# EAGLE design MJ818 clone - rev.5 - TCAN334 - poc (EAGLE 9.6.2)
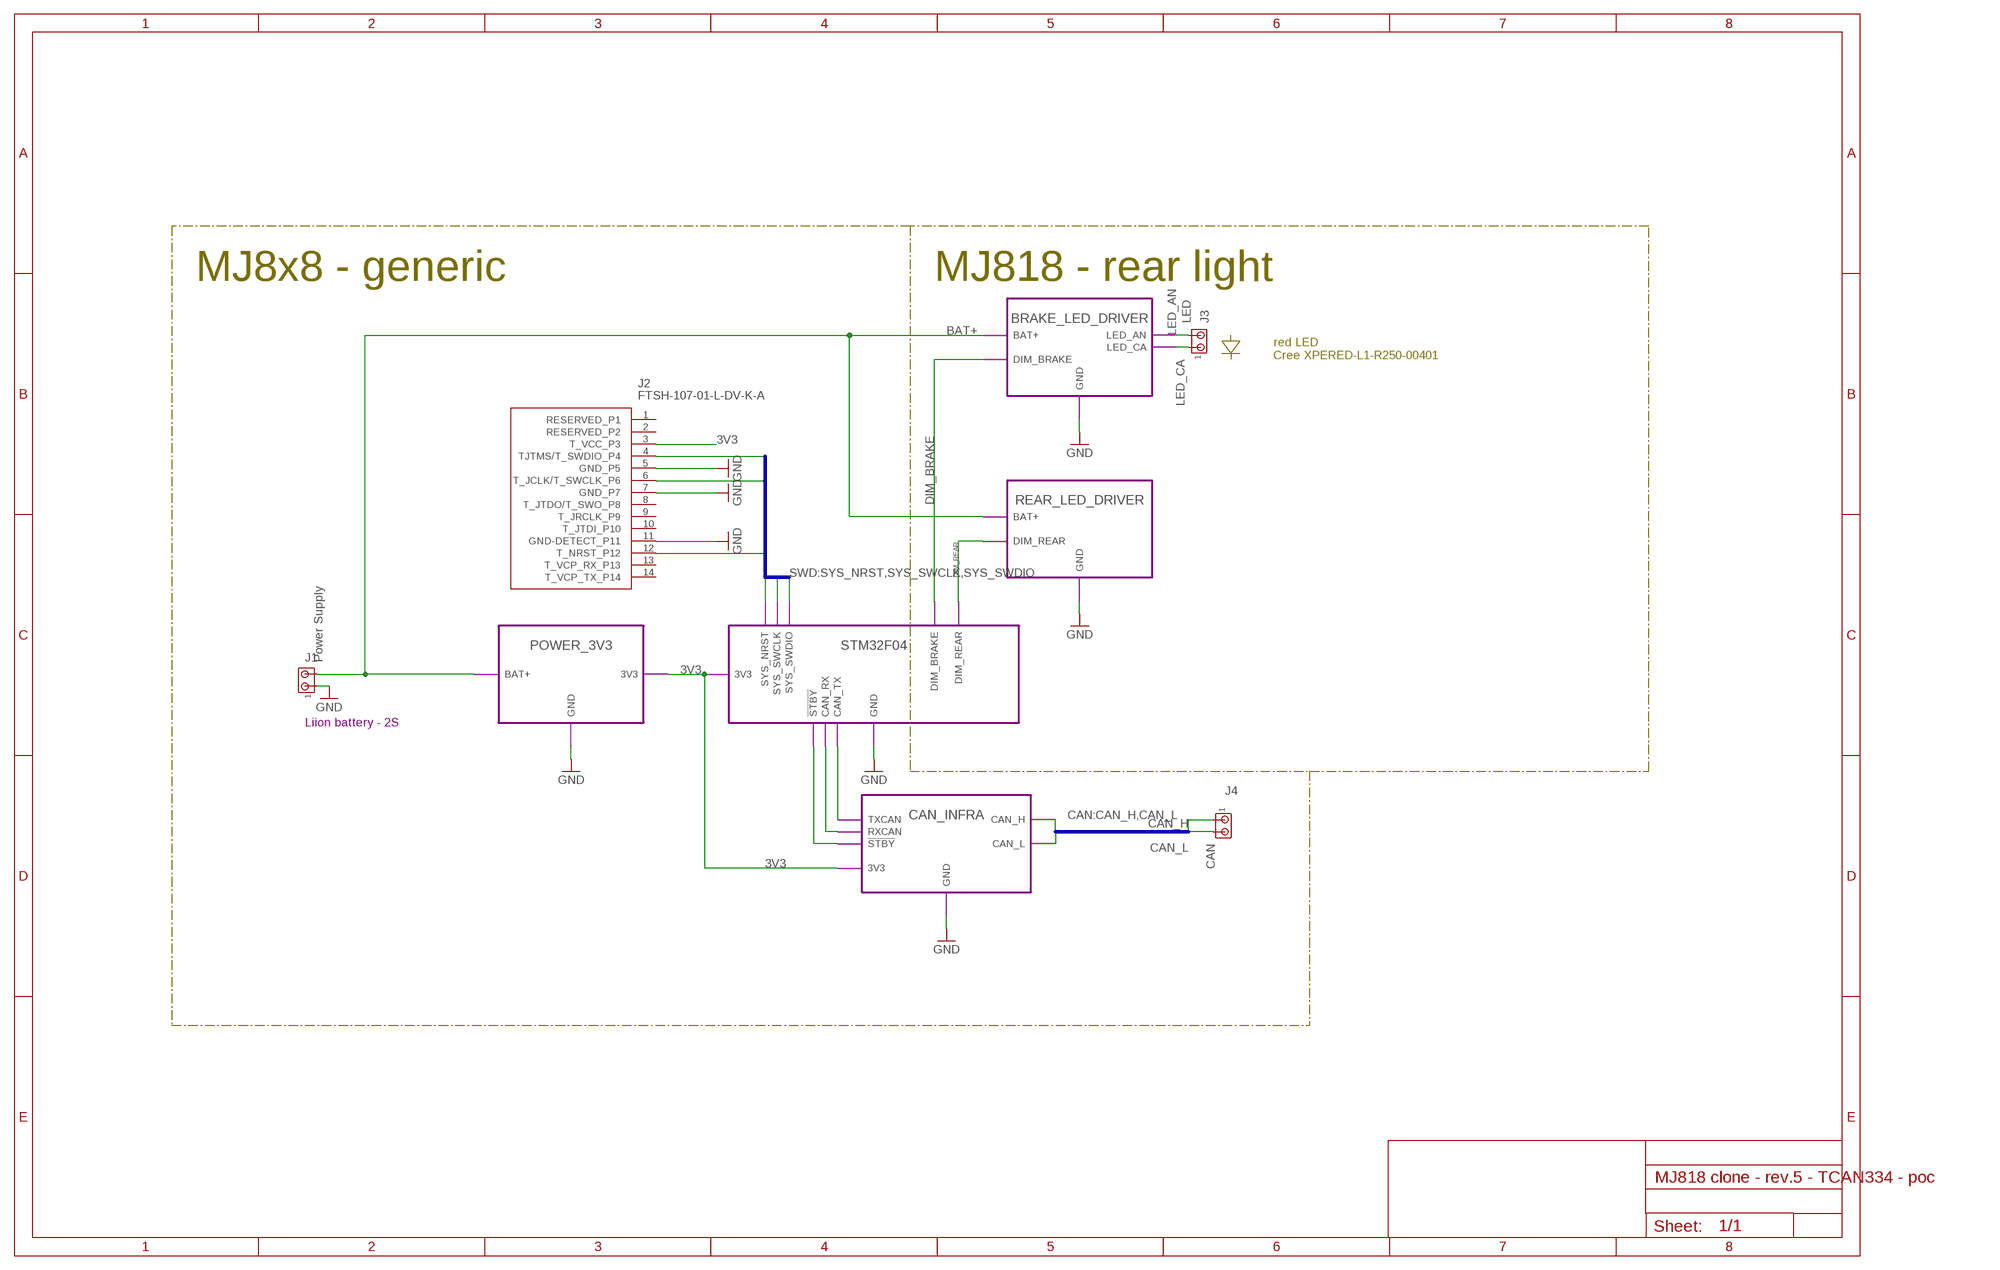
[diagram p0: schematic, sheet 1]

## Parts
J1  Power Supply  MTA02-100  [10X02MTA]
J2  FTSH-107-01-L-DV-K-A  [FTSH10701LDVKA]
J3  LED  MTA02-100  [10X02MTA]
J4  CAN  MTA02-100  [10X02MTA]

## Module instances
POWER_3V3 = POWER_3V3 (part numbers offset by 200)
STM32F04 = STM32 (part numbers offset by 300)
CAN_INFRA = CAN_INFRA (part numbers offset by 400)
BRAKE_LED_DRIVER = LED_DRIVER_BRAKE-LIGHT (part numbers offset by 500)
REAR_LED_DRIVER = LED_DRIVER_REAR-LIGHT (part numbers offset by 600)

## Nets
3V3 [3V3]: J2.3(T_VCC_P3) ; port POWER_3V3.3V3 STM32F04.3V3 CAN_INFRA.3V3
!STBY! [signal]: port CAN_INFRA.!STBY! STM32F04.!STBY!
BAT+ [BAT+]: J1.2 ; port POWER_3V3.BAT+ BRAKE_LED_DRIVER.BAT+ REAR_LED_DRIVER.BAT+
CAN_H [signal]: J4.1 ; port CAN_INFRA.CAN_H
CAN_L [signal]: J4.2 ; port CAN_INFRA.CAN_L
CAN_RX [signal]: port CAN_INFRA.RXCAN STM32F04.CAN_RX
CAN_TX [signal]: port CAN_INFRA.TXCAN STM32F04.CAN_TX
DIM_BRAKE [signal]: port STM32F04.DIM_BRAKE BRAKE_LED_DRIVER.DIM_BRAKE
DIM_REAR [signal]: port STM32F04.DIM_REAR REAR_LED_DRIVER.DIM_REAR
GND: J1.1 J2.5(GND_P5) J2.7(GND_P7) J2.11(GND-DETECT_P11) ; port STM32F04.GND POWER_3V3.GND CAN_INFRA.GND BRAKE_LED_DRIVER.GND REAR_LED_DRIVER.GND
LED_AN [BAT+]: J3.2 ; port BRAKE_LED_DRIVER.LED_AN
LED_CA [BAT+]: J3.1 ; port BRAKE_LED_DRIVER.LED_CA
SYS_NRST [signal]: J2.12(T_NRST_P12) ; port STM32F04.SYS_NRST
SYS_SWCLK [signal]: J2.6(T_JCLK/T_SWCLK_P6) ; port STM32F04.SYS_SWCLK
SYS_SWDIO [signal]: J2.4(TJTMS/T_SWDIO_P4) ; port STM32F04.SYS_SWDIO
Unconnected: J2.1(RESERVED_P1) J2.2(RESERVED_P2) J2.8(T_JTDO/T_SWO_P8) J2.9(T_JRCLK_P9) J2.10(T_JTDI_P10) J2.13(T_VCP_RX_P13) J2.14(T_VCP_TX_P14)

## Buses
CAN:CAN_H,CAN_L
SWD:SYS_NRST,SYS_SWCLK,SYS_SWDIO

## Notes on the sheet
- MJ8x8 - generic | MJ818 - rear light
- red LED
  Cree XPERED-L1-R250-00401
- Liion battery - 2S

## Library data of the parts
J1 J3 J4 = con-amp:MTA02-100: AMP connector
J2 = STM32 JTAG 1.27mm 14pin header:FTSH-107-01-L-DV-K-A: Headers & Wire Housings .050" Micro Terminal Strip Source: Datasheet <https://componentsearchengine.com/Datasheets/1/FTSH-107-01-L-DV-K-A.pdf>; DESCRIPTION: Headers & Wire Housings .050" Micro Terminal Strip; HEIGHT: 5.97mm; MANUFACTURER_NAME: SAMTEC; MANUFACTURER_PART_NUMBER: FTSH-107-01-L-DV-K-A; MOUSER_PART_NUMBER: 200-FTSH10701LDVKA; MOUSER_PRICE-STOCK: https://www.mouser.com/Search/Refine.aspx?Keyword=200-FTSH10701LDVKA

## Module POWER_3V3
Ports: GND(pwr) BAT+(pwr) 3V3(pwr)
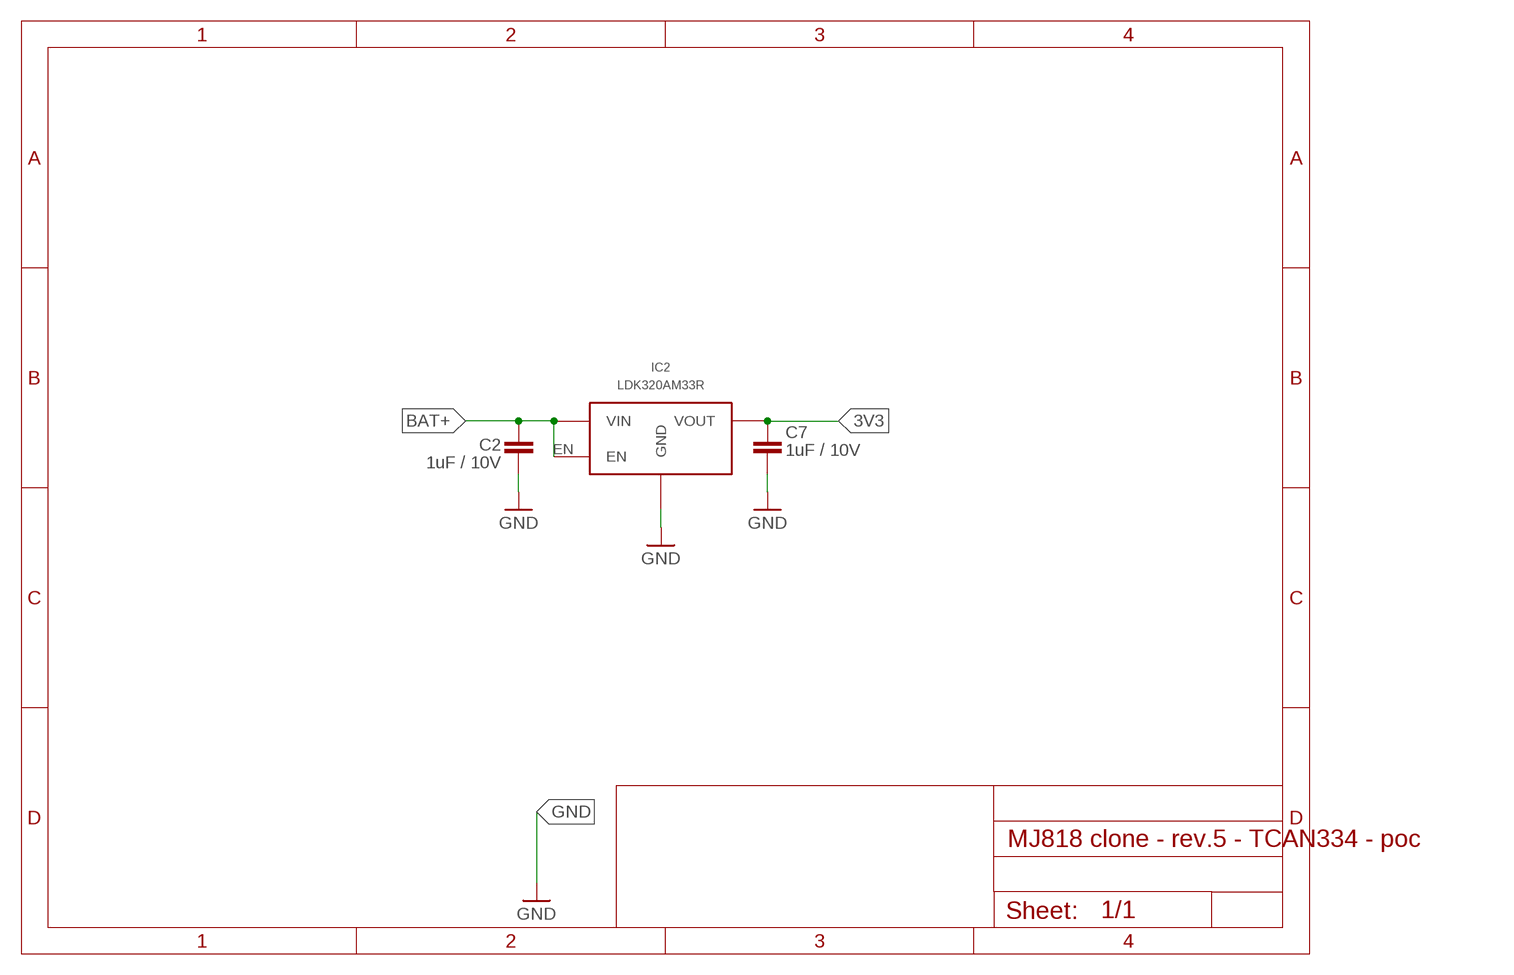
[diagram p1: schematic, module POWER_3V3, sheet 1]

### Parts
C2  1uF / 10V  C-EUC0402  [C0402]
C7  1uF / 10V  C-EUC0402  [C0402]
IC2  LDK320AM33R  LDK320SOT-23-5L  [SOT-23-5L]

### Nets
3V3: C7.2 IC2.OUT(VOUT)
BAT+ [BAT+]: C2.1 IC2.EN IC2.IN(VIN)
GND: C2.2 C7.1 IC2.GND

### Library data of the parts
C2 C7 = rcl:C-EU: CAPACITOR, European symbol; SPICEPREFIX: C
IC2 = LDK320 5V LDO:LDK320

## Module STM32
Ports: GND(pwr) 3V3(pwr) SYS_NRST(in) SYS_SWCLK(io) SYS_SWDIO(io) CAN_RX(in) CAN_TX(out) !STBY!(out) DIM_REAR(out) DIM_BRAKE(out)
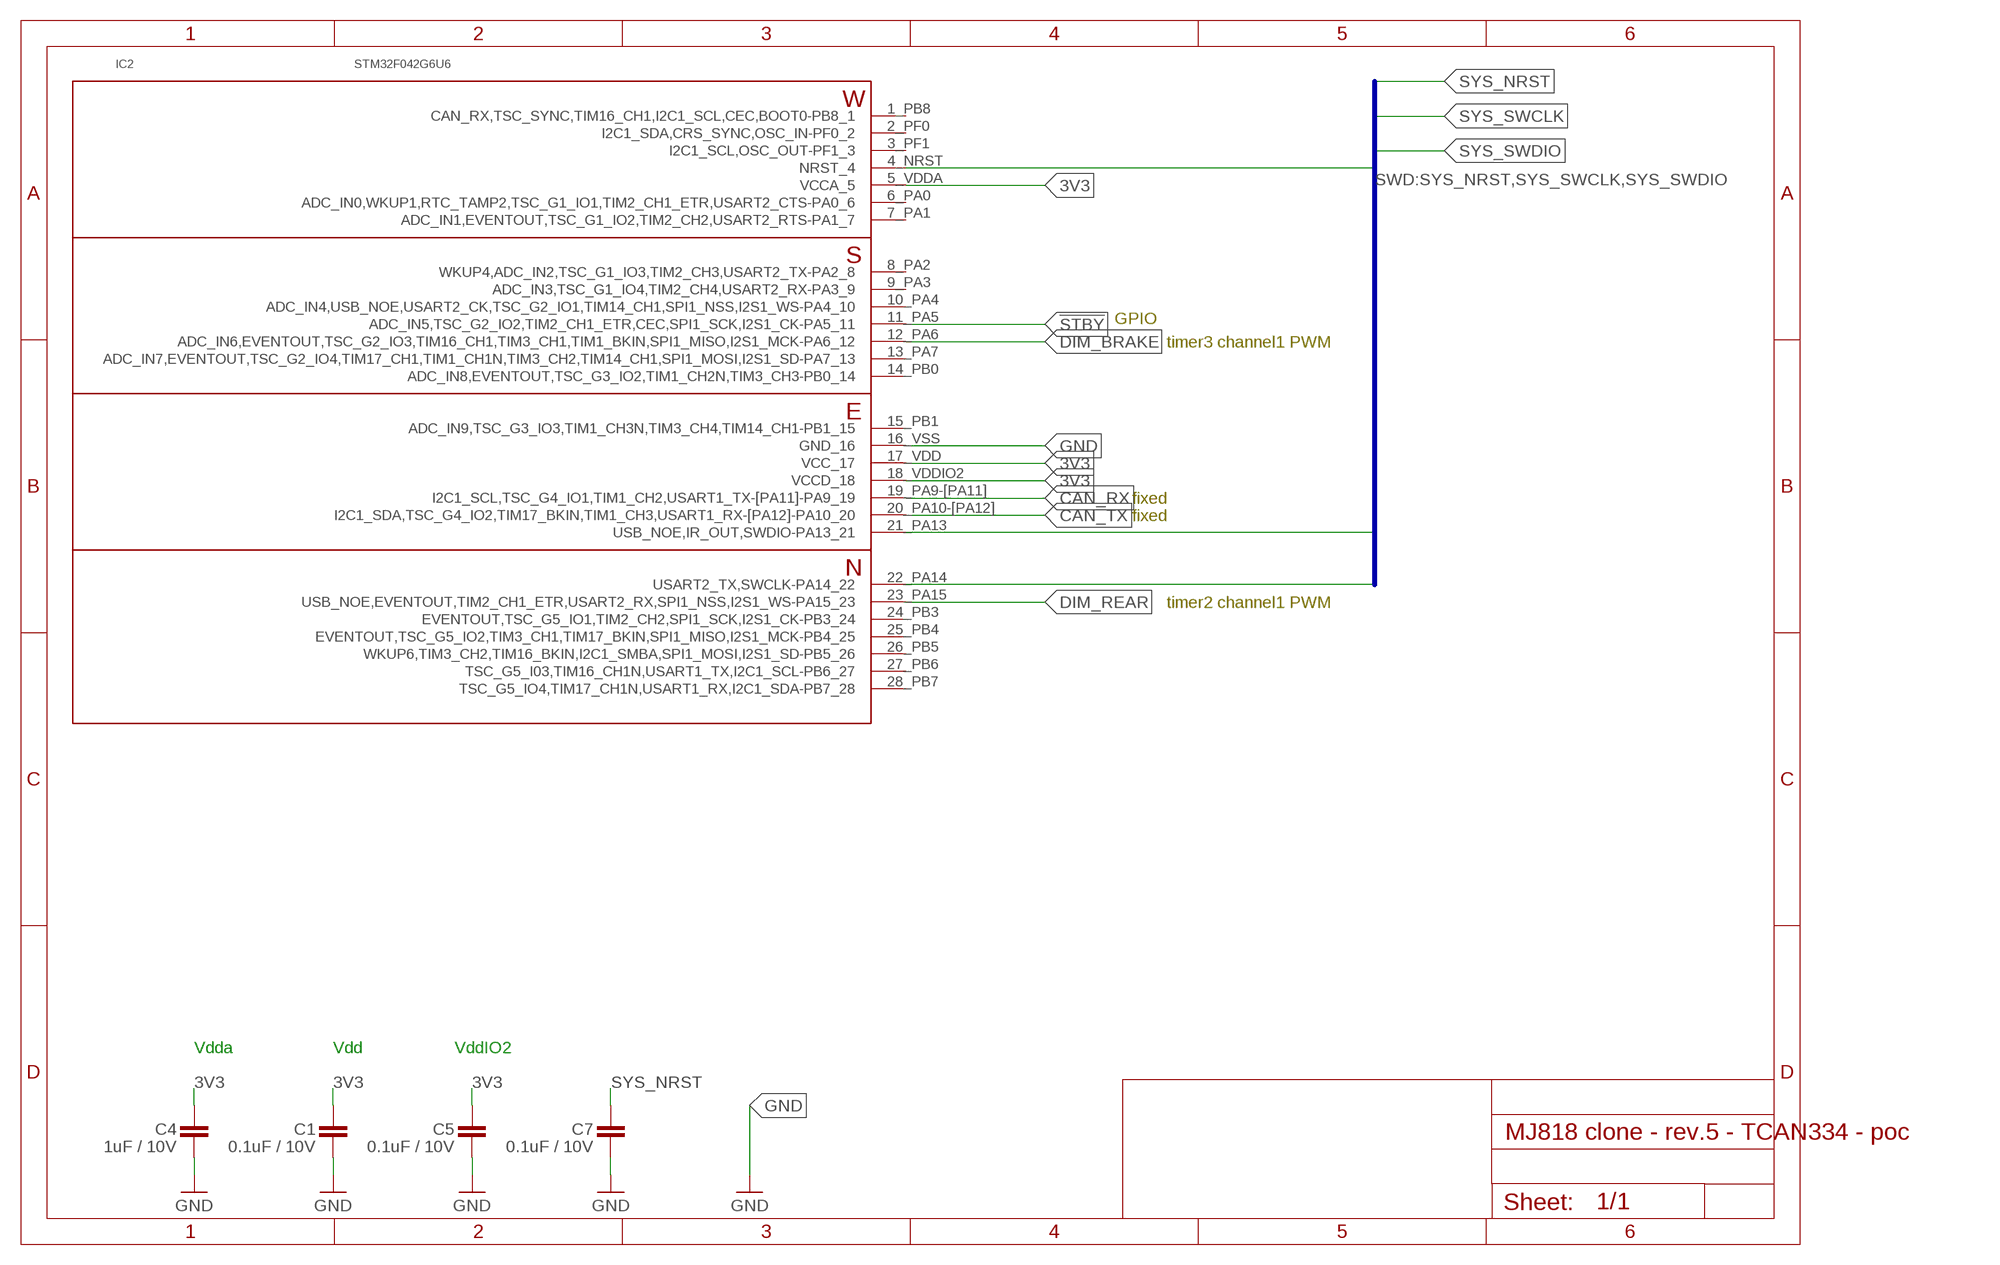
[diagram p2: schematic, module STM32, sheet 1]

### Parts
C1  0.1uF / 10V  C-EUC0402  [C0402]
C4  1uF / 10V  C-EUC0402  [C0402]
C5  0.1uF / 10V  C-EUC0402  [C0402]
C7  0.1uF / 10V  C-EUC0402  [C0402]
IC2  STM32F042G6U6  STM32F042G6  [UFQFPN-28]

### Nets
3V3 [3V3]: C1.2 C4.2 C5.2 IC2.5_VDDA(VCCA_5) IC2.17_VDD(VCC_17) IC2.18_VDDIO2(VCCD_18)
!STBY!: IC2.11_PA5(ADC_IN5,TSC_G2_IO2,TIM2_CH1_ETR,CEC,SPI1_SCK,I2S1_CK-PA5_11)
CAN_RX: IC2.19_PA9-[PA11](I2C1_SCL,TSC_G4_IO1,TIM1_CH2,USART1_TX-[PA11]-PA9_19)
CAN_TX: IC2.20_PA10-[PA12](I2C1_SDA,TSC_G4_IO2,TIM17_BKIN,TIM1_CH3,USART1_RX-[PA12]-PA10_20)
DIM_BRAKE: IC2.12_PA6(ADC_IN6,EVENTOUT,TSC_G2_IO3,TIM16_CH1,TIM3_CH1,TIM1_BKIN,SPI1_MISO,I2S1_MCK-PA6_12)
DIM_REAR: IC2.23_PA15(USB_NOE,EVENTOUT,TIM2_CH1_ETR,USART2_RX,SPI1_NSS,I2S1_WS-PA15_23)
GND: C1.1 C4.1 C5.1 C7.1 IC2.16_VSS(GND_16)
SYS_NRST: C7.2 IC2.4_NRST(NRST_4)
SYS_SWCLK: IC2.22_PA14(USART2_TX,SWCLK-PA14_22)
SYS_SWDIO: IC2.21_PA13(USB_NOE,IR_OUT,SWDIO-PA13_21)
Unconnected: IC2.1_PB8(CAN_RX,TSC_SYNC,TIM16_CH1,I2C1_SCL,CEC,BOOT0-PB8_1) IC2.2_PF0(I2C1_SDA,CRS_SYNC,OSC_IN-PF0_2) IC2.3_PF1(I2C1_SCL,OSC_OUT-PF1_3) IC2.6_PA0(ADC_IN0,WKUP1,RTC_TAMP2,TSC_G1_IO1,TIM2_CH1_ETR,USART2_CTS-PA0_6) IC2.7_PA1(ADC_IN1,EVENTOUT,TSC_G1_IO2,TIM2_CH2,USART2_RTS-PA1_7) IC2.8_PA2(WKUP4,ADC_IN2,TSC_G1_IO3,TIM2_CH3,USART2_TX-PA2_8) IC2.9_PA3(ADC_IN3,TSC_G1_IO4,TIM2_CH4,USART2_RX-PA3_9) IC2.10_PA4(ADC_IN4,USB_NOE,USART2_CK,TSC_G2_IO1,TIM14_CH1,SPI1_NSS,I2S1_WS-PA4_10) IC2.13_PA7(ADC_IN7,EVENTOUT,TSC_G2_IO4,TIM17_CH1,TIM1_CH1N,TIM3_CH2,TIM14_CH1,SPI1_MOSI,I2S1_SD-PA7_13) IC2.14_PB0(ADC_IN8,EVENTOUT,TSC_G3_IO2,TIM1_CH2N,TIM3_CH3-PB0_14) IC2.15_PB1(ADC_IN9,TSC_G3_IO3,TIM1_CH3N,TIM3_CH4,TIM14_CH1-PB1_15) IC2.24_PB3(EVENTOUT,TSC_G5_IO1,TIM2_CH2,SPI1_SCK,I2S1_CK-PB3_24) IC2.25_PB4(EVENTOUT,TSC_G5_IO2,TIM3_CH1,TIM17_BKIN,SPI1_MISO,I2S1_MCK-PB4_25) IC2.26_PB5(WKUP6,TIM3_CH2,TIM16_BKIN,I2C1_SMBA,SPI1_MOSI,I2S1_SD-PB5_26) IC2.27_PB6(TSC_G5_I03,TIM16_CH1N,USART1_TX,I2C1_SCL-PB6_27) IC2.28_PB7(TSC_G5_IO4,TIM17_CH1N,USART1_RX,I2C1_SDA-PB7_28)

### Buses
SWD:SYS_NRST,SYS_SWCLK,SYS_SWDIO

### Notes on the sheet
- GPIO
- timer3 channel1 PWM
- fixed
- fixed
- timer2 channel1 PWM
- Vdda | Vdd | VddIO2

### Library data of the parts
C1 C4 C5 C7 = rcl:C-EU: CAPACITOR, European symbol; SPICEPREFIX: C
IC2 = STM32F042G6:STM32F042G6

## Module CAN_INFRA
Ports: GND(pwr) 3V3(pwr) CAN_H(io) CAN_L(io) TXCAN(in) RXCAN(out) !STBY!(in)
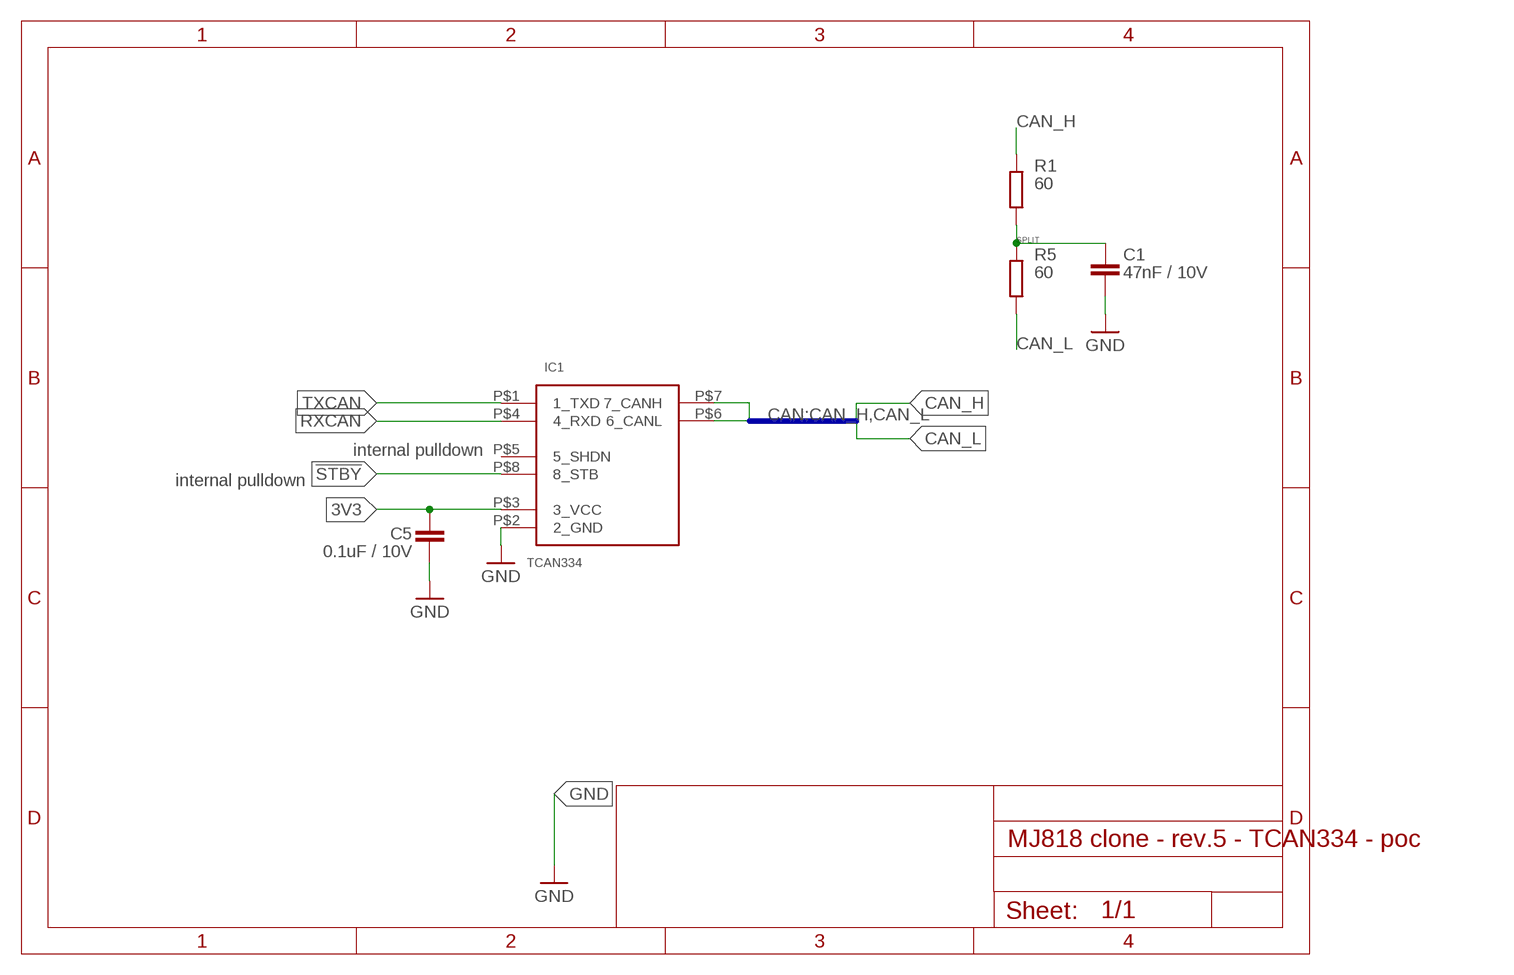
[diagram p3: schematic, module CAN_INFRA, sheet 1]

### Parts
C1  47nF / 10V  C-EUC0402  [C0402]
C5  0.1uF / 10V  C-EUC0402  [C0402]
IC1  TCAN334  CAN33X  [SOT23-8]
R1  60  R-EU_R0805  [R0805]
R5  60  R-EU_R0805  [R0805]

### Nets
3V3 [3V3]: C5.1 IC1.P$3(3_VCC)
!STBY! [signal]: IC1.P$8(8_STB)
CAN_H: IC1.P$7(7_CANH) R1.2
CAN_L: IC1.P$6(6_CANL) R5.1
GND: C1.2 C5.2 IC1.P$2(2_GND)
RXCAN [signal]: IC1.P$4(4_RXD)
SPLIT [signal]: C1.1 R1.1 R5.2
TXCAN [signal]: IC1.P$1(1_TXD)
Unconnected: IC1.P$5(5_SHDN)

### Buses
CAN:CAN_H,CAN_L

### Notes on the sheet
- internal pulldown
- internal pulldown

### Library data of the parts
C1 C5 = rcl:C-EU: CAPACITOR, European symbol; SPICEPREFIX: C
IC1 = TCAN33x - 3.3V CAN Transciever:CAN33X
R1 R5 = rcl:R-EU_: RESISTOR, European symbol; SPICEPREFIX: R

## Module LED_DRIVER_BRAKE-LIGHT
Ports: GND(pwr) LED_AN(pwr) LED_CA(pwr) DIM_BRAKE(in) BAT+(pwr)
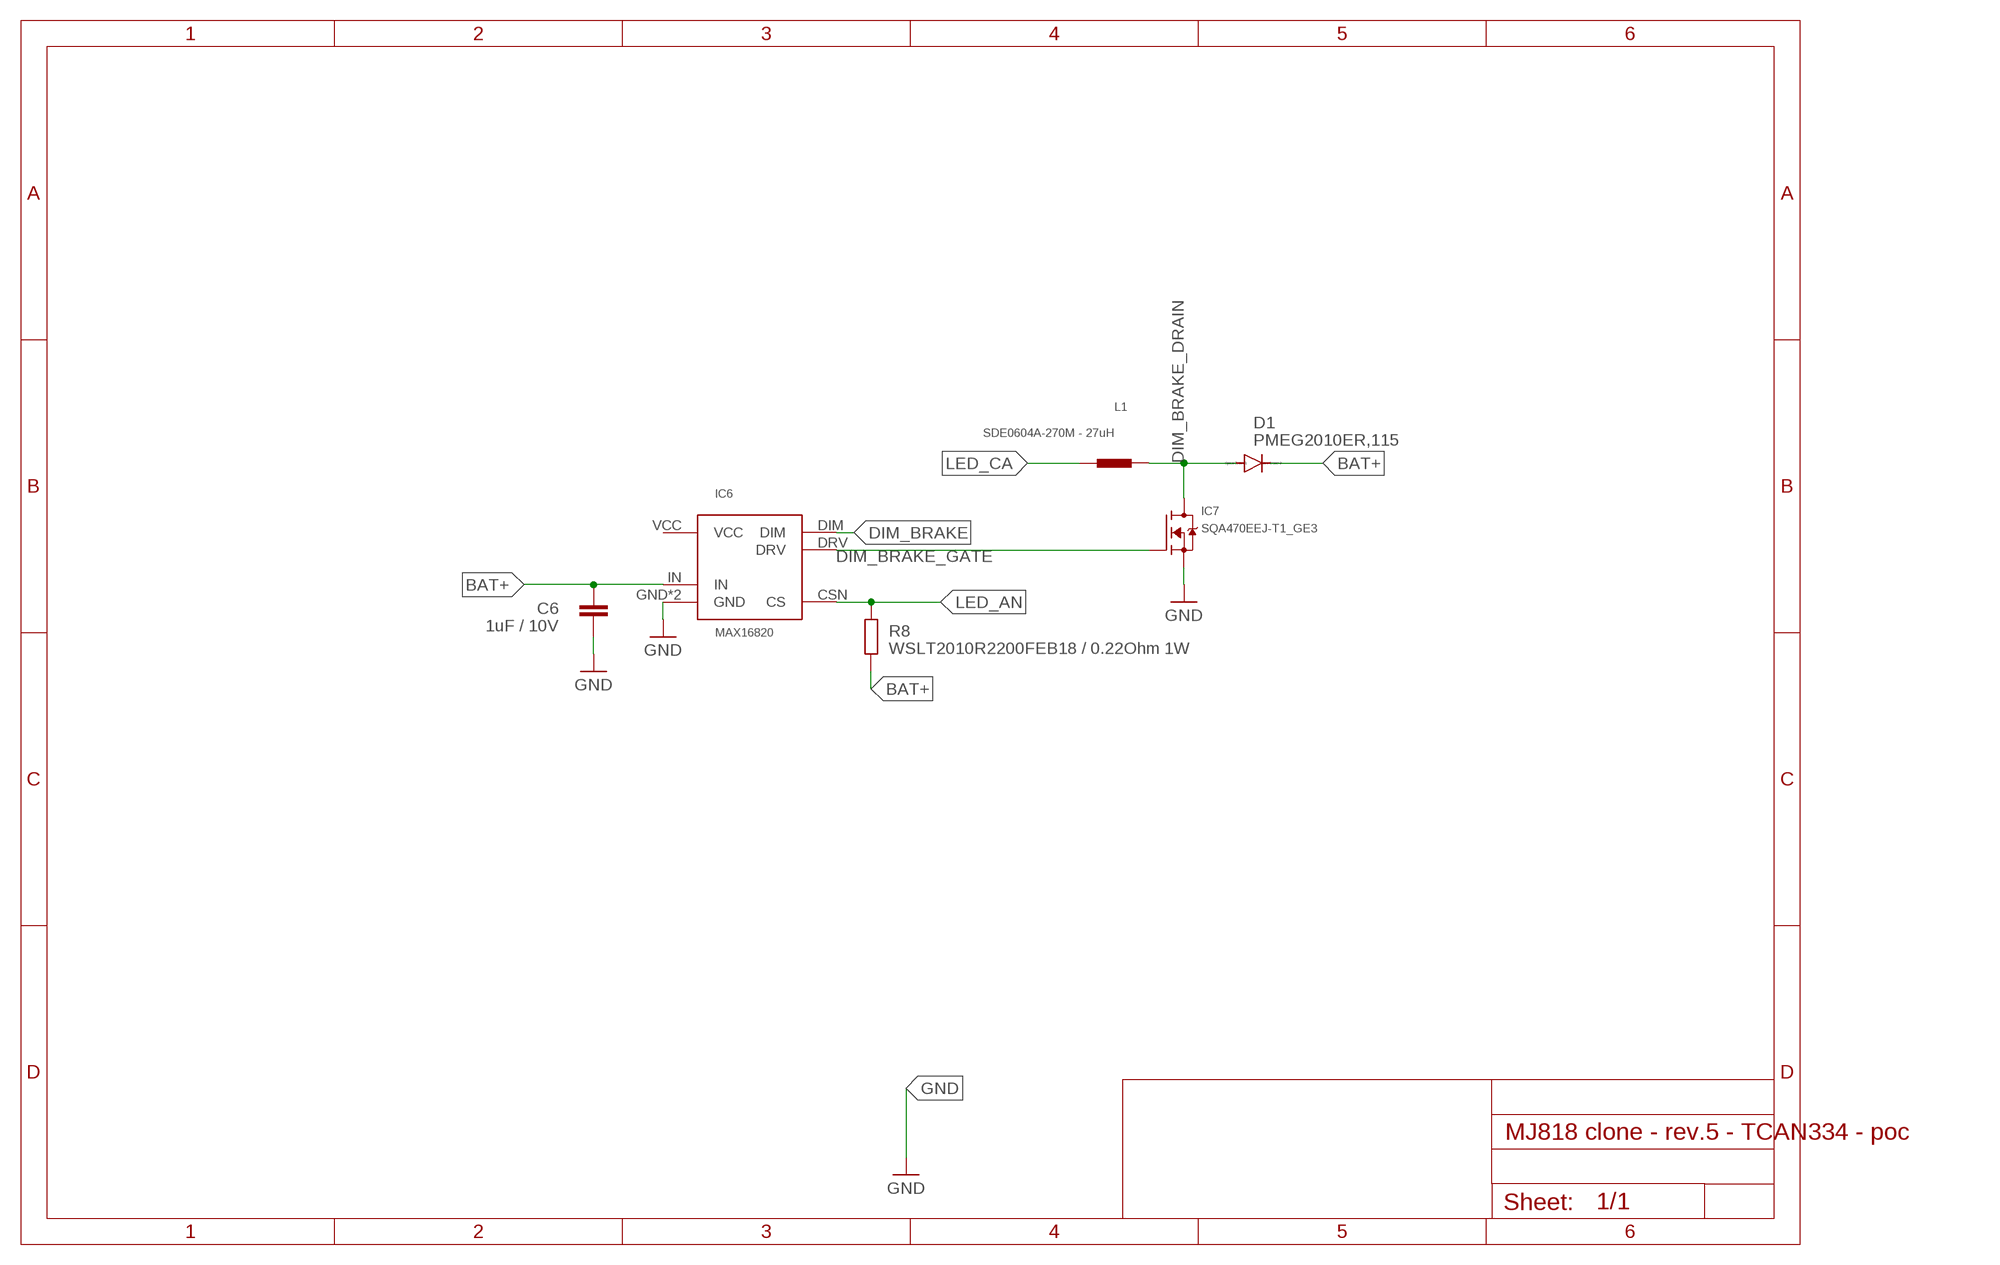
[diagram p4: schematic, module LED_DRIVER_BRAKE-LIGHT, sheet 1]

### Parts
C6  1uF / 10V  C-EUC0402  [C0402]
D1  PMEG2010ER,115  DIODE-SOD123  [SOD123]
IC6  MAX16820  [TDFN-6-EP]
IC7  SQA470EEJ-T1_GE3  SIA456DJ  [SC-70-6]
L1  SDE0604A-270M - 27uH  DE0604A-778075  [SMT]
R8  WSLT2010R2200FEB18 / 0.22Ohm 1W  R-EU_R2010  [R2010]

### Nets
BAT+ [BAT+]: C6.1 D1.C IC6.IN R8.2
DIM_BRAKE [signal]: IC6.DIM
DIM_BRAKE_DRAIN [signal]: D1.A IC7.1D(D) IC7.2D(D) IC7.5D(D) IC7.6D(D) IC7.D L1.P$2
DIM_BRAKE_GATE [signal]: IC6.DRV IC7.3G(G)
GND: C6.2 IC6.GND IC6.GND1(GND) IC7.4S(S) IC7.S
LED_AN [BAT+]: IC6.CSN(CS) R8.1
LED_CA [BAT+]: L1.P$1

### Power pins joined to a net without a drawn wire
VCC: IC6.VCC

### Library data of the parts
C6 = rcl:C-EU: CAPACITOR, European symbol; SPICEPREFIX: C
D1 = diode:DIODE-: DIODE
IC6 = MAX16820 LED Driver, constant current:MAX16820
IC7 = SIA456DJ-T1-GE3  N-Fet:SIA456DJ
L1 = DE0604A-778075 - Inductor:DE0604A-778075
R8 = rcl:R-EU_: RESISTOR, European symbol; SPICEPREFIX: R

## Module LED_DRIVER_REAR-LIGHT
Ports: GND(pwr) BAT+(pwr) DIM_REAR(in)
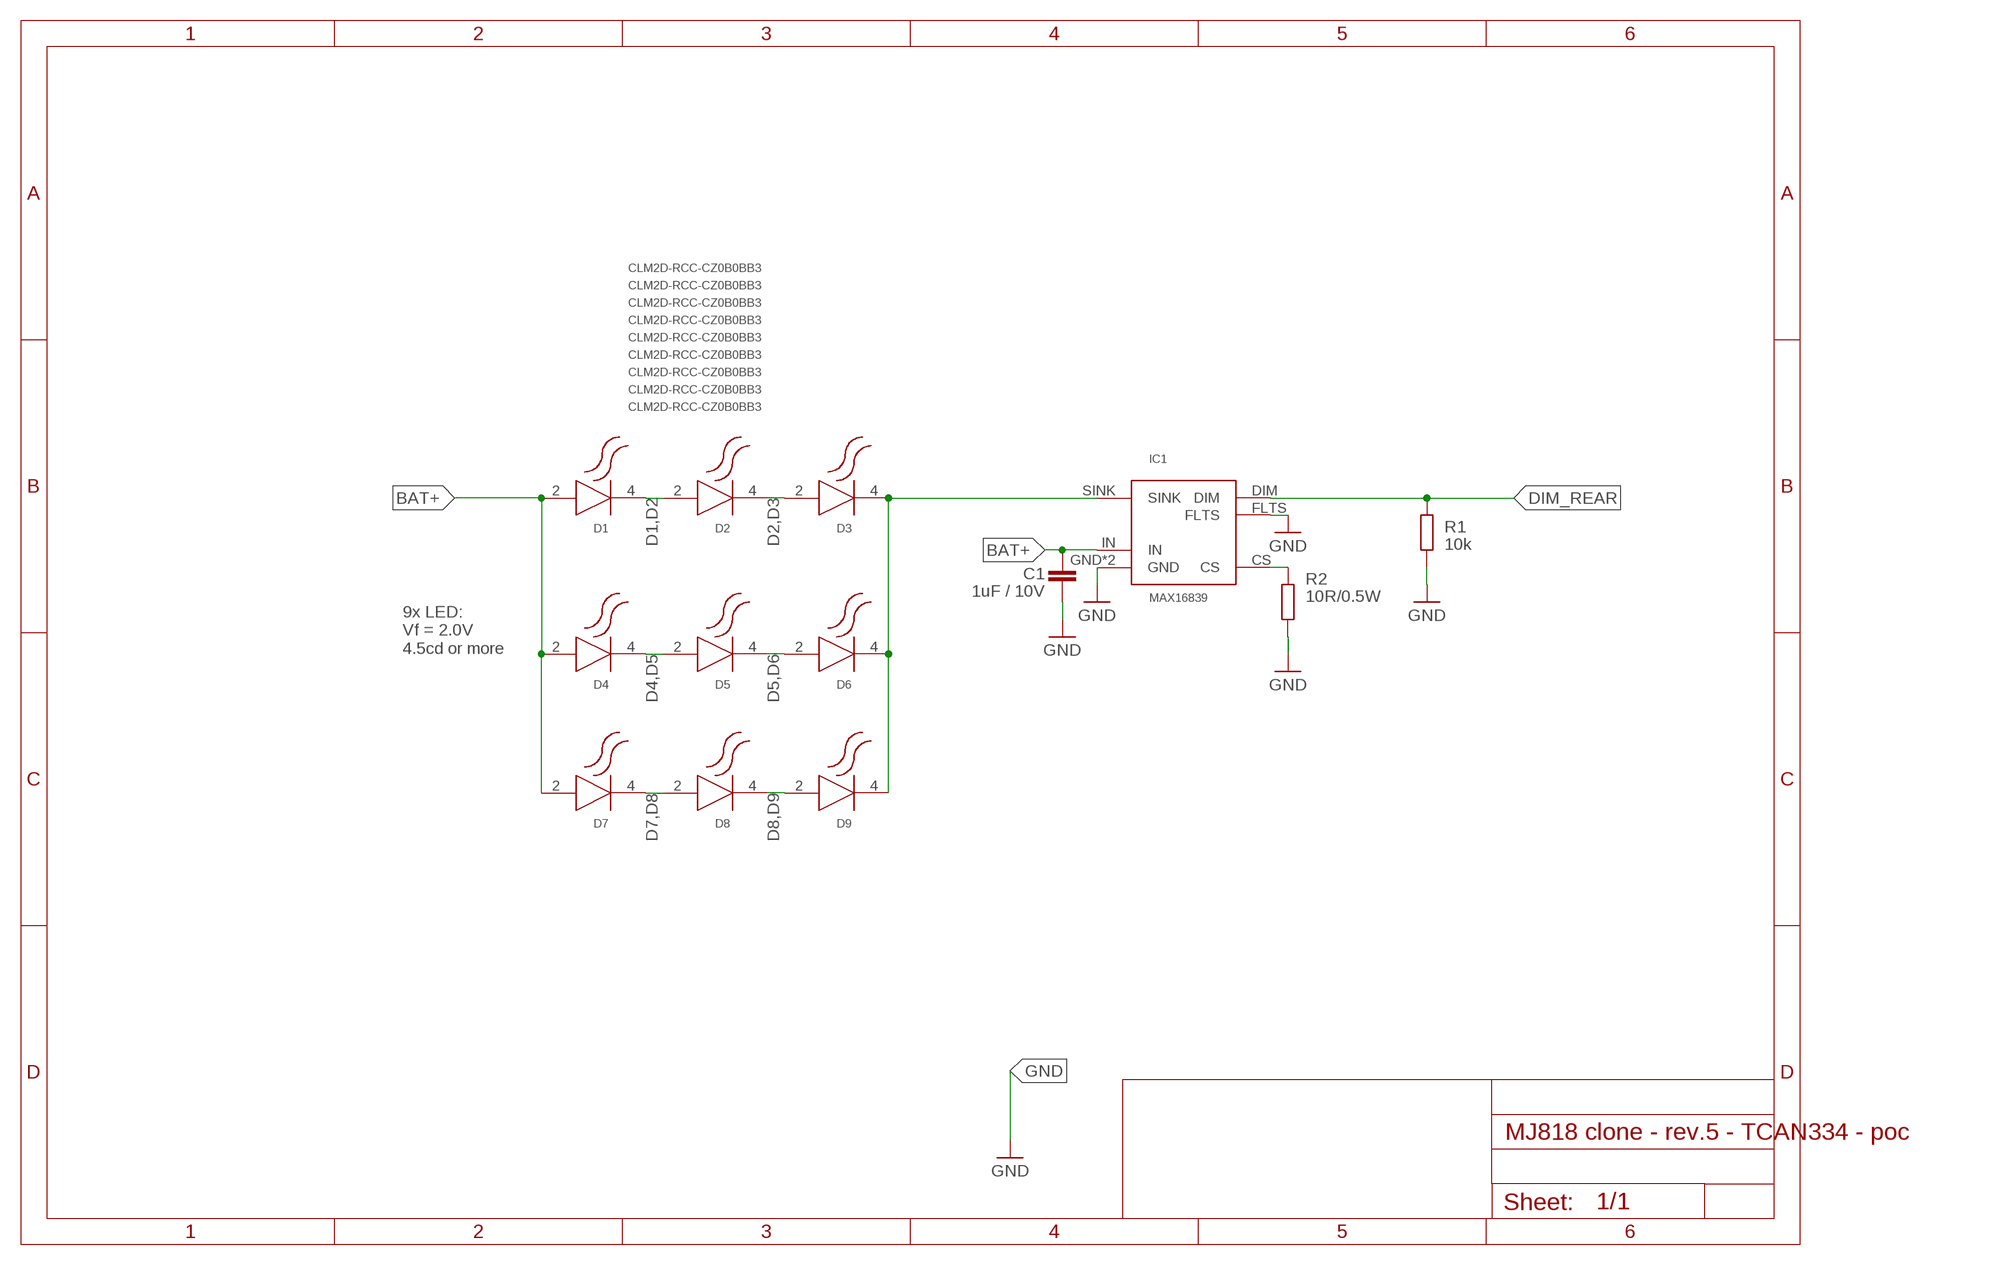
[diagram p5: schematic, module LED_DRIVER_REAR-LIGHT, sheet 1]

### Parts
C1  1uF / 10V  C-EUC0402  [C0402]
D1  CLM2D-RCC-CZ0B0BB3  1374-CLM2D-RCC-ACC-1064252  [SMD]
D2  CLM2D-RCC-CZ0B0BB3  1374-CLM2D-RCC-ACC-1064252  [SMD]
D3  CLM2D-RCC-CZ0B0BB3  1374-CLM2D-RCC-ACC-1064252  [SMD]
D4  CLM2D-RCC-CZ0B0BB3  1374-CLM2D-RCC-ACC-1064252  [SMD]
D5  CLM2D-RCC-CZ0B0BB3  1374-CLM2D-RCC-ACC-1064252  [SMD]
D6  CLM2D-RCC-CZ0B0BB3  1374-CLM2D-RCC-ACC-1064252  [SMD]
D7  CLM2D-RCC-CZ0B0BB3  1374-CLM2D-RCC-ACC-1064252  [SMD]
D8  CLM2D-RCC-CZ0B0BB3  1374-CLM2D-RCC-ACC-1064252  [SMD]
D9  CLM2D-RCC-CZ0B0BB3  1374-CLM2D-RCC-ACC-1064252  [SMD]
IC1  MAX16839  MAX16839  [TDFN-6-EP]
R1  10k  R-EU_R0402  [R0402]
R2  10R/0.5W  R-EU_R0603  [R0603]

### Nets
BAT+ [BAT+]: C1.2 D1.2(A) D4.2(A) D7.2(A) IC1.IN
CS [BAT+]: IC1.CS R2.1
D1,D2 [BAT+]: D1.4(C) D2.2(A)
D2,D3 [BAT+]: D2.4(C) D3.2(A)
D4,D5 [BAT+]: D4.4(C) D5.2(A)
D5,D6 [BAT+]: D5.4(C) D6.2(A)
D7,D8 [BAT+]: D7.4(C) D8.2(A)
D8,D9 [BAT+]: D8.4(C) D9.2(A)
DIM_REAR [signal]: IC1.DIM R1.2
GND: C1.1 IC1.FLTS IC1.GND IC1.GND1(GND) R1.1 R2.2
SINK [BAT+]: D3.4(C) D6.4(C) D9.4(C) IC1.SINK

### Notes on the sheet
- 9x LED:
  Vf = 2.0V
  4.5cd or more

### Library data of the parts
C1 = rcl:C-EU: CAPACITOR, European symbol; SPICEPREFIX: C
D1-D9 = 1374-CLM2D-RCC-ACC-1064252 - Red SMD LED:1374-CLM2D-RCC-ACC-1064252
IC1 = MAX16839 LED Driver, constant current:MAX16839
R1 R2 = rcl:R-EU_: RESISTOR, European symbol; SPICEPREFIX: R

## Net classes
0 GND: width 0.25 mm, drill 0.35 mm, clearance 0.19 mm
1 BAT+: width 0.4 mm, drill 0.35 mm, clearance 0.19 mm
3 signal: width 0.25 mm, drill 0.35 mm, clearance 0.19 mm
4 3V3: width 0.25 mm, drill 0.35 mm, clearance 0.19 mm

## Board
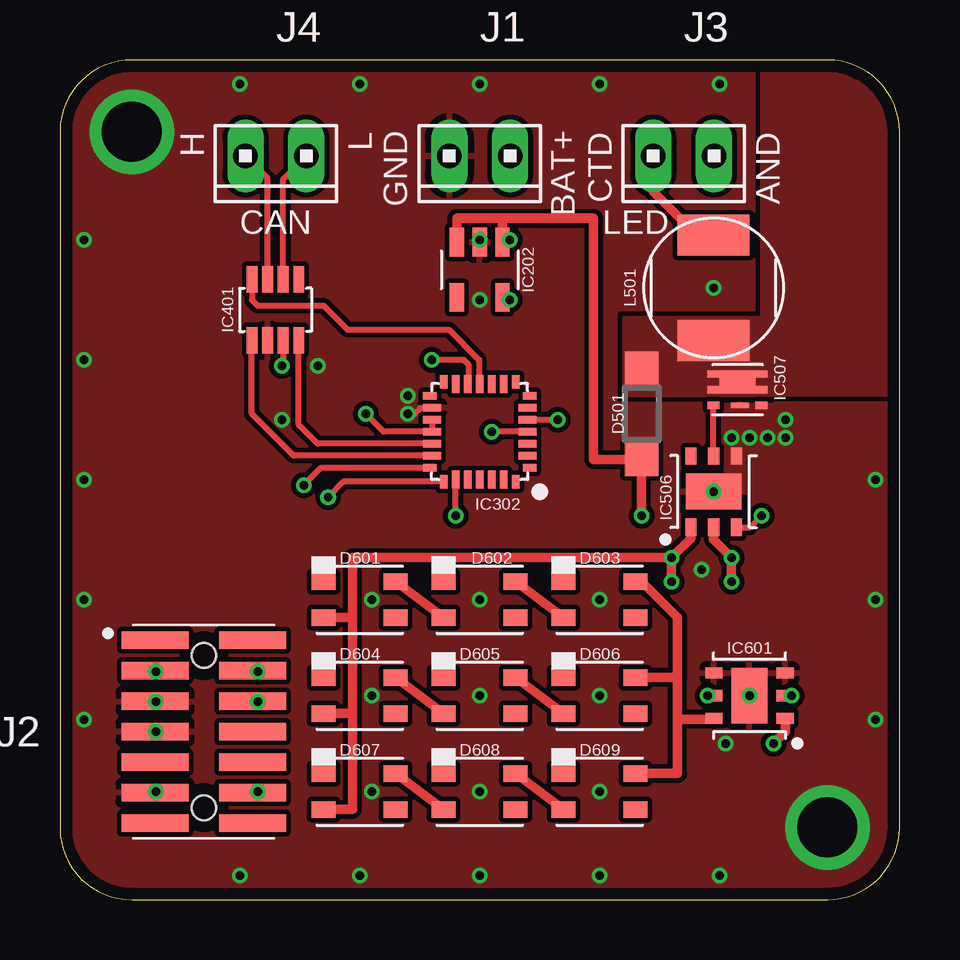
[diagram p6: board, top side]
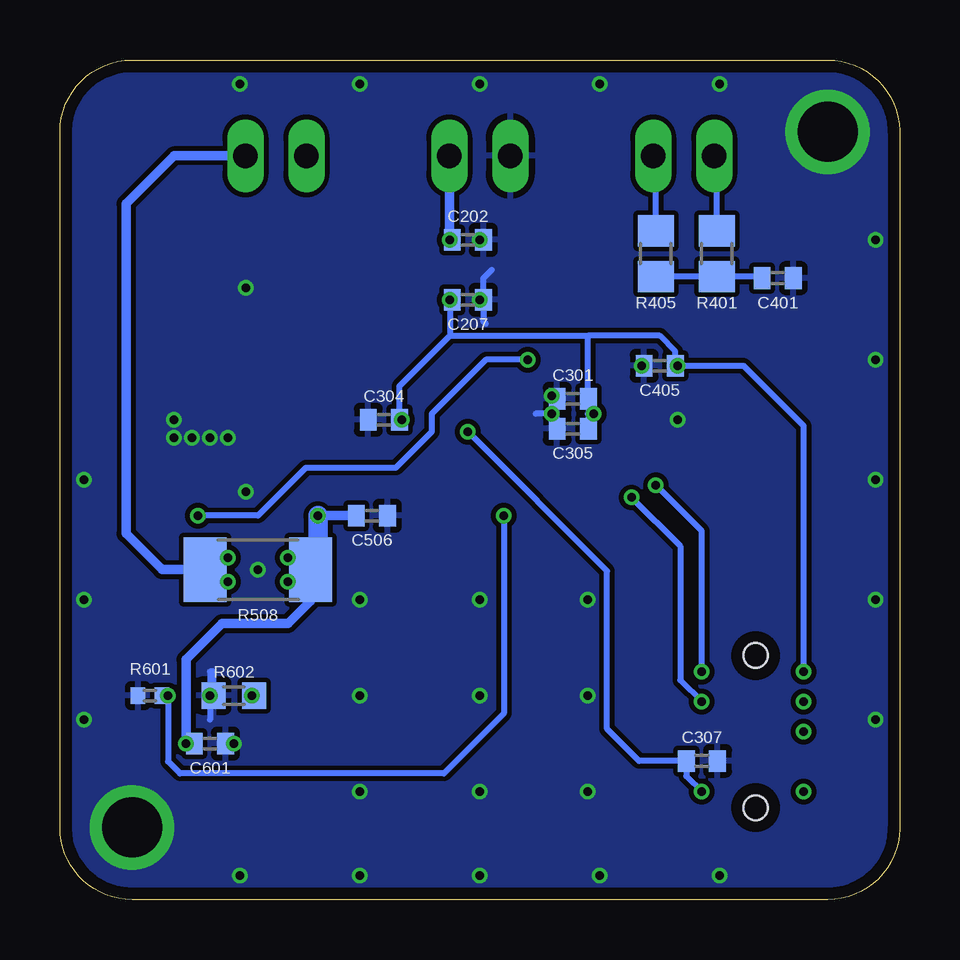
[diagram p7: board, bottom side, seen from below]

Size 35 x 35 mm. Coordinates in mm from the lower left corner, seen from the top.
Outline: 32,35 3,35 arc89 0,32.05 0,2.95 arc90 3,0 32,0 arc90 35,3 35,32 arc90 32,35
Copper layers (1*16): Top 0.035mm / dielectric 1.5mm / Bottom 0.035mm
Design rules "markovac_2layer": minimum track width 0.2mm, minimum drill 0.35mm, track to track 0.2mm, track to pad 0.2mm, pad to pad 0.2mm, via to via 0.2mm, smd to smd 0.2mm, copper to edge 0.5mm, drill to drill 8mil, minimum pad ring 0.15mm, minimum via ring 0.15mm, stop-mask expansion 4mil, vias tented up to drill 0.35mm, thermal gap 10mil
tRestrict: 4 lines

### Footprints (pad centres in the part's own frame; a part is rotated, then mirrored left to right if it is on the bottom)
C0402 = smd 0.7 x 0.9: 1 -0.65,0; 2 0.65,0
SOD123 = smd 1.4 x 1.4: A 1.9,0; C -1.9,0
SMD = smd 1 x 0.7: 1 -1.5,0.75; 2 -1.5,-0.75; 3 1.5,-0.75; 4 1.5,0.75
SOT-23-5L = smd 0.6 x 1.2: ADJ/NC -0.95,-1.15; EN -0.95,1.15; GND 0,1.15; IN 0.95,1.15; OUT 0.95,-1.15
UFQFPN-28 = smd 0.55 x 0.3: 1_PB8 -2.08,1.5; 7_PA1 -2.08,-1.5; 15_PB1 2.08,-1.5; 21_PA13 2.08,1.5 | smd 0.75 x 0.3: 2_PF0 -1.98,1; 3_PF1 -1.98,0.5; 4_NRST -1.98,0; 5_VDDA -1.98,-0.5; 6_PA0 -1.98,-1; 16_VSS 1.98,-1; 17_VDD 1.98,-0.5; 18_VDDIO2 1.98,0; 19_PA9-[PA11] 1.98,0.5; 20_PA10-[PA12] 1.98,1 | smd 0.3 x 0.55: 8_PA2 -1.5,-2.08; 14_PB0 1.5,-2.08; 22_PA14 1.5,2.08; 28_PB7 -1.5,2.08 | smd 0.3 x 0.75: 9_PA3 -1,-1.98; 10_PA4 -0.5,-1.98; 11_PA5 0,-1.98; 12_PA6 0.5,-1.98; 13_PA7 1,-1.98; 23_PA15 1,1.98; 24_PB3 0.5,1.98; 25_PB4 0,1.98; 26_PB5 -0.5,1.98; 27_PB6 -1,1.98
SOT23-8 = smd 0.45 x 1.1: P$1 -0.975,-1.275; P$2 -0.325,-1.275; P$3 0.325,-1.275; P$4 0.975,-1.275; P$5 0.975,1.275; P$6 0.325,1.275; P$7 -0.325,1.275; P$8 -0.975,1.275
TDFN-6-EP = smd 0.71 x 0.46: CSN -1.48,0; DIM -1.48,-0.94; DRV 1.48,0; GND1 1.48,-0.95; IN -1.48,0.94; VCC 1.48,0.95 | smd 1.5 x 2.3: GND 0,0
SC-70-6 = smd 0.5 x 0.3: 1D -1,0.65; 2D -1,0; 3G -1,-0.65; 4S 1,-0.65; 5D 1,0; 6D 1,0.65 | smd 1.5 x 0.95: D 0,0.325 | smd 0.75 x 0.23: S 0.1,-0.65
TDFN-6-EP' = smd 0.71 x 0.46: CS 1.48,0; DIM -1.48,0; FLTS -1.48,-0.94; GND1 1.48,-0.95; IN -1.48,0.94; SINK 1.48,0.95 | smd 1.5 x 2.3: GND 0,0
10X02MTA = drill 1.016 long: 1 1.27,0; 2 -1.27,0
FTSH10701LDVKA = smd 0.74 x 2.79: 1 -3.81,-2.035; 2 -3.81,2.035; 3 -2.54,-2.035; 4 -2.54,2.035; 5 -1.27,-2.035; 6 -1.27,2.035; 7 0,-2.035; 8 0,2.035; 9 1.27,-2.035; 10 1.27,2.035; 11 2.54,-2.035; 12 2.54,2.035; 13 3.81,-2.035; 14 3.81,2.035 | hole 1.02: -3.175,0; 3.175,0
SMT = smd 1.7 x 3: P$1 2.2,0; P$2 -2.2,0
R0805 = smd 1.3 x 1.5: 1 -0.95,0; 2 0.95,0
R2010 = smd 1.8 x 2.7: 1 -2.2,0; 2 2.2,0
R0402 = smd 0.6 x 0.7: 1 -0.5,0; 2 0.5,0
R0603 = smd 1 x 1.1: 1 -0.85,0; 2 0.85,0

### Placement (x,y rotation side)
C202  1uF / 10V  [C0402]  18,27.5 0 bottom
C207  1uF / 10V  [C0402]  18,25 180 bottom
C301  0.1uF / 10V  [C0402]  13.62,20.88 0 bottom
C304  1uF / 10V  [C0402]  21.5,20 0 bottom
C305  0.1uF / 10V  [C0402]  13.62,19.63 0 bottom
C307  0.1uF / 10V  [C0402]  8.24,5.78 180 bottom
C401  47nF / 10V  [C0402]  5.08,25.91 0 bottom
C405  0.1uF / 10V  [C0402]  10,22.25 180 bottom
C506  1uF / 10V  [C0402]  22,16 0 bottom
C601  1uF / 10V  [C0402]  28.75,6.5 180 bottom
D501  PMEG2010ER,115  [SOD123]  24.25,20.25 90 top
D601  CLM2D-RCC-CZ0B0BB3  [SMD]  12.5,12.5 0 top
D602  CLM2D-RCC-CZ0B0BB3  [SMD]  17.5,12.5 0 top
D603  CLM2D-RCC-CZ0B0BB3  [SMD]  22.5,12.5 0 top
D604  CLM2D-RCC-CZ0B0BB3  [SMD]  12.5,8.5 0 top
D605  CLM2D-RCC-CZ0B0BB3  [SMD]  17.5,8.5 0 top
D606  CLM2D-RCC-CZ0B0BB3  [SMD]  22.5,8.5 0 top
D607  CLM2D-RCC-CZ0B0BB3  [SMD]  12.5,4.5 0 top
D608  CLM2D-RCC-CZ0B0BB3  [SMD]  17.5,4.5 0 top
D609  CLM2D-RCC-CZ0B0BB3  [SMD]  22.5,4.5 0 top
IC202  LDK320AM33R  [SOT-23-5L]  17.5,26.25 0 top
IC302  STM32F042G6U6  [UFQFPN-28]  17.5,19.5 180 top
IC401  TCAN334  [SOT23-8]  8.98,24.59 0 top
IC506  MAX16820  [TDFN-6-EP]  27.25,17 90 top
IC507  SQA470EEJ-T1_GE3  [SC-70-6]  28.25,21.25 0 top
IC601  MAX16839  [TDFN-6-EP']  28.75,8.5 180 top
J1  17.5,31 180 top
J2  6,7 270 top
J3  26,31 180 top
J4  9,31 180 top
L501  SDE0604A-270M - 27uH  [SMT]  27.25,25.5 90 top
R401  60  [R0805]  7.62,26.93 90 bottom
R405  60  [R0805]  10.16,26.93 270 bottom
R508  WSLT2010R2200FEB18 / 0.22Ohm 1W  [R2010]  26.75,13.75 0 bottom
R601  10k  [R0402]  31.25,8.5 0 bottom
R602  10R/0.5W  [R0603]  27.75,8.5 180 bottom

### Tracks (layer width: path | path; a pad name or v marks a point on that pad's centre or on a via)
3V3  (via drill 0.35)
  Top 0.25: IC302.17_VDD IC302.18_VDDIO2 13.5,19.5 v12.75,20.25 | IC302.5_VDDA v20.75,20 | IC401.P$3 9.3,22.31 v9.25,22.25 | IC202.OUT 18.65,25.1 v18.75,25 | J2.3 4,9.54 v4,9.5
  Bottom 0.25: v12.75,20.25 12.97,20.25 | 12.97,20.25 13,20.25 | 12.97,20.25 C305.2 | v20.75,20 C304.2 20.85,21.4 18.75,23.5 | 13,23.5 13,21 12.97,20.98 C301.2 12.97,20.25 | v18.75,25 C207.2 18.75,24.9 18.75,23.5 | v4,9.5 4,19.75 6.5,22.25 v9.25,22.25 C405.1 9.35,22.85 10,23.5 13,23.5 | 18.75,23.5 13,23.5
!STBY!
  Top 0.25: IC401.P$8 8,25 8.25,24.75 11,24.75 12,23.75 16.21,23.75 17.47,22.49 17.47,21.51 IC302.11_PA5
BAT+  (via drill 0.35)
  Top 0.4: IC202.EN 16.55,28.4 18.45,28.4 | 18.45,28.4 IC202.IN 18.55,27.5 v18.75,27.5 | v29.75,6.5 30.23,6.98 IC601.IN | v24.25,16 D501.C 22.25,18.35 22.25,28.4 18.45,28.4 | IC506.IN 26.31,15.06 v25.5,14.25 | v25.5,13.25 v25.5,14.25 | v25.5,14.25 12.19,14.25 12.19,11.75 | D607.2 12.19,3.75 12.19,7.75 | 12.19,7.75 12.19,11.75 | D601.2 12.19,11.75 | D604.2 12.19,7.75
  Bottom 0.4: 24.25,14.25 v25.5,14.25 | C506.1 v24.25,16 | v25.5,13.25 24.55,13.25 R508.2 24.55,12.45 25.5,11.5 28.25,11.5 29.75,10 29.75,6.85 C601.2 v29.75,6.5 | C202.1 v18.75,27.5 18.77,27.52 J1.2
  Bottom 0.813: v24.25,16 24.25,14.25
BRAKE_LED_DRIVER:DIM_BRAKE_DRAIN
  pour Top (rank 3, no thermals): 29.5,21 29.5,24.25 23.5,24.25 23.5,21
  pour Top (no thermals): 29.25,24.25 29.25,37 33,37 34.5,37 34.5,21 29.25,21
BRAKE_LED_DRIVER:DIM_BRAKE_GATE
  Top 0.25: IC506.DRV IC507.3G
CAN_H
  Top 0.25: IC401.P$7 8.65,30.08 J4.1
  Bottom 0.25: R401.2 7.62,30.89 J4.1
CAN_INFRA:SPLIT
  Bottom 0.25: C401.1 5.8,25.98 R401.1 R405.2
CAN_L
  Top 0.25: IC401.P$6 9.3,30.04 J4.2
  Bottom 0.25: R405.1 10.16,30.89 J4.2
CAN_RX
  Top 0.25: IC302.19_PA9-[PA11] 10.75,19 9.95,19.8 IC401.P$4
CAN_TX
  Top 0.25: IC302.20_PA10-[PA12] 9.75,18.5 8,20.25 IC401.P$1
DIM_BRAKE  (via drill 0.35)
  Top 0.25: IC506.DIM 28.77,15.52 v29.25,16 | v15.5,22.5 16.83,22.5 17.02,22.3 17.02,21.51 IC302.12_PA6
  Bottom 0.25: v29.25,16 26.75,16 24.75,18 21,18 19.5,19.5 19.5,20.25 17.25,22.5 v15.5,22.5
DIM_REAR  (via drill 0.35)
  Top 0.25: v16.5,16 IC302.23_PA15 | IC601.DIM v30.5,8.5
  Bottom 0.25: v16.5,16 16.5,7.75 19,5.25 30,5.25 30.5,5.75 v30.5,8.5 R601.2
GND  (via drill 0.35, 2.5)
  Top 0.25: IC302.16_VSS 15.49,20.48 15.01,20.48 14.78,20.25 v14.5,20.25
  Bottom 0.25: C305.1 14.27,20.03 v14.5,20.25 | C301.1 14.5,20.88 v14.5,20.25 | v14.5,20.25 15.17,20.25 | 17,26.25 17.35,25.9 C207.1 17.35,24.1 17.25,24 | R602.2 28.6,9.5 28.75,9.5 28.75,7.5
  other vias: 3,32 32,3 17.5,25 28.75,8.5 27.75,6.5 27.25,17 28,19.25 28.75,19.25 29.5,19.25 30.25,19.25 30.25,20 9.25,20 34,17.5 1,17.5 1,12.5 1,7.5 1,22.5 1,27.5 17.5,1 22.5,1 27.5,1 12.5,1 7.5,1 34,12.5 34,7.5 17.5,34 22.5,34 27.5,34 12.5,34 7.5,34 14.5,21 17.5,27.5 13.01,12.5 13.01,8.5 17.5,12.5 17.5,8.5 22.5,8.5 22.5,12.5 22.5,4.5 17.5,4.5 13.01,4.5 26.75,13.75 27.25,25.5 10.75,22.25
  pour Top (rank 6): 0,35 35,35 35,0 0,0
  pour Bottom (rank 6): 0,35 35,35 35,0 0,0
  pour Top (no thermals): 27.75,20.5 30.75,20.5 30.75,17 27.75,17
LED_AN  (via drill 0.35)
  Top 0.4: v28,13.25 v28,14.25 27.25,15 IC506.CSN
  Bottom 0.4: J3.2 30.25,31 32.25,29 32.25,15.25 30.75,13.75 R508.1 28.95,13.25 v28,13.25
LED_CA
  Top 0.4: J3.1 24.73,29.52 26.55,27.7 L501.P$1
N$1  (via drill 0.35)
  other vias: 4,8.25
N$2  (via drill 0.35)
  other vias: 4,7
N$3  (via drill 0.35)
  other vias: 4,4.5
REAR_LED_DRIVER:CS  (via drill 0.35)
  Top 0.4: v27,8.5 IC601.CS
  Bottom 0.4: R602.1 v27,8.5
REAR_LED_DRIVER:D1,D2
  Top 0.4: D601.4 D602.2
REAR_LED_DRIVER:D2,D3
  Top 0.4: D602.4 D603.2
REAR_LED_DRIVER:D4,D5
  Top 0.4: D604.4 D605.2
REAR_LED_DRIVER:D5,D6
  Top 0.4: D605.4 D606.2
REAR_LED_DRIVER:D7,D8
  Top 0.4: D607.4 D608.2
REAR_LED_DRIVER:D8,D9
  Top 0.4: D608.4 D609.2
REAR_LED_DRIVER:SINK
  Top 0.4: D609.4 25.75,5.25 25.75,7.5 | 25.75,9.25 D606.4 | 25.75,7.5 25.75,9.25 | 25.75,9.25 25.75,11.75 24.25,13.25 D603.4 | IC601.SINK 27.27,7.5 25.75,7.5
SYS_NRST  (via drill 0.35)
  Top 0.25: IC302.4_NRST v18,19.5 | v8.25,4.5 8.03,4.5 J2.12
  Bottom 0.25: v8.25,4.5 8.89,5.14 C307.2 10.86,5.78 12.19,7.11 12.19,13.69 v18,19.5
SYS_SWCLK  (via drill 0.35)
  Top 0.25: IC302.22_PA14 11.83,17.42 v11.18,16.77 | J2.6 8.25,8.27 v8.25,8.25
  Bottom 0.25: v11.18,16.77 9.14,14.73 9.14,9.15 v8.25,8.25
SYS_SWDIO  (via drill 0.35)
  Top 0.25: v10.16,17.27 10.89,18 IC302.21_PA13 | J2.4 8.25,9.54 v8.25,9.5
  Bottom 0.25: v8.25,9.5 8.25,15.36 v10.16,17.27

### Text on the board
tPlace: H | L | GND | BAT+ | CTD | AND | CAN | LED
tStop: MJ818 POC / ejovrh rev.5a